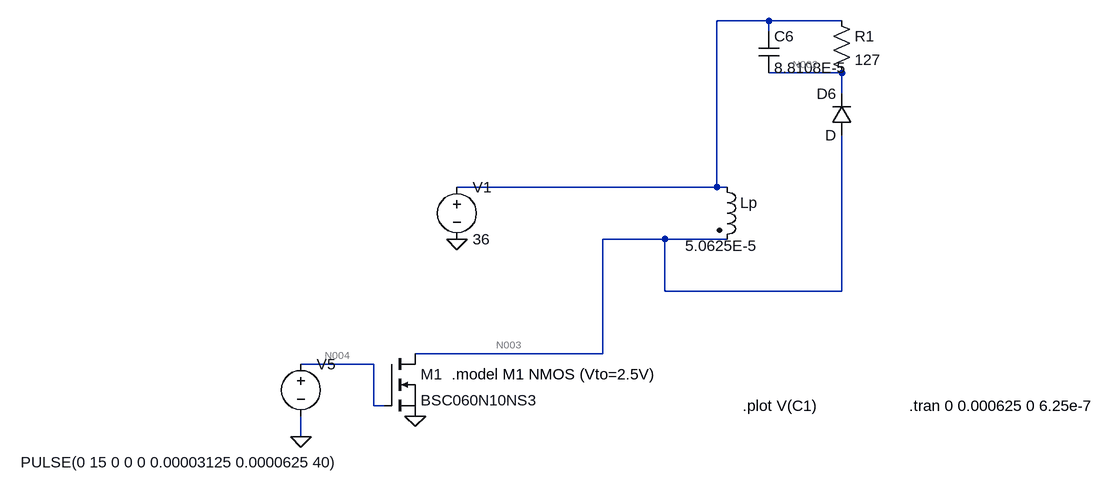
[diagram p0: schematic DriverSnubberModelling1.asc]
DriverSnubberModelling1.asc, the LTspice schematic file:
Version 4
SHEET 1 880 832
WIRE -624 -192 -704 -192
WIRE -512 -192 -624 -192
WIRE -624 -176 -624 -192
WIRE -512 -112 -624 -112
WIRE -512 -80 -512 -112
WIRE -704 64 -704 -192
WIRE -704 64 -1104 64
WIRE -688 64 -704 64
WIRE -784 144 -880 144
WIRE -688 144 -784 144
WIRE -784 224 -784 144
WIRE -512 224 -512 -16
WIRE -512 224 -784 224
WIRE -880 320 -880 144
WIRE -880 320 -1168 320
WIRE -1232 336 -1344 336
WIRE -1232 400 -1232 336
WIRE -1216 400 -1232 400
WIRE -1344 448 -1344 416
FLAG -1104 144 0
FLAG -1344 448 0
FLAG -1168 416 0
SYMBOL ind2 -704 48 R0
WINDOW 3 -49 106 Left 2
SYMATTR Value 5.0625E-5
SYMATTR InstName Lp
SYMATTR Type ind
SYMBOL voltage -1104 48 R0
WINDOW 123 0 0 Left 0
WINDOW 39 0 0 Left 0
SYMATTR InstName V1
SYMATTR Value 36
SYMBOL voltage -1344 320 R0
WINDOW 3 -431 167 Left 2
WINDOW 123 0 0 Left 0
WINDOW 39 0 0 Left 0
SYMATTR Value PULSE(0 15 0 0 0 0.00003125 0.0000625 40)
SYMATTR InstName V5
SYMBOL nmos -1216 320 R0
SYMATTR InstName M1
SYMATTR Value BSC060N10NS3
SYMBOL res -528 -208 R0
SYMATTR InstName R1
SYMATTR Value 127
SYMBOL cap -640 -176 R0
SYMATTR InstName C6
SYMATTR Value 8.8108E-5
SYMBOL diode -496 -16 R180
WINDOW 0 24 64 Left 2
WINDOW 3 24 0 Left 2
SYMATTR InstName D6
TEXT -408 400 Left 2 !.tran 0 0.000625 0 6.25e-7
TEXT -664 400 Left 2 !.plot V(C1)
TEXT -1112 352 Left 2 !.model M1 NMOS (Vto=2.5V)

The netlist it stands for:
* DriverSnubberModelling1.asc
Lp N001 N003 5.0625E-5
V1 N001 0 36
V5 N004 0 PULSE(0 15 0 0 0 0.00003125 0.0000625 40)
M1 N003 N004 0 0 BSC060N10NS3
R1 N001 N002 127
C6 N001 N002 8.8108E-5
D6 N003 N002 D
.model D D
.lib standard.dio
.model NMOS NMOS
.model PMOS PMOS
.lib standard.mos
.tran 0 0.000625 0 6.25e-7
.plot V(C1)
.model M1 NMOS (Vto=2.5V)
.backanno
.end

* Results of the author's LTspice run, read from the files saved beside the schematic
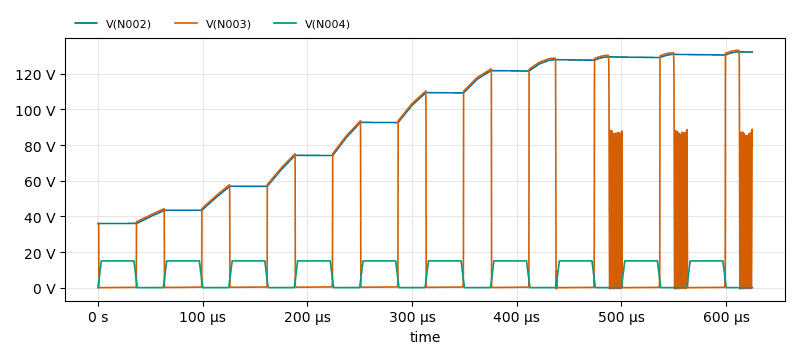
[diagram p1: Transient Analysis of DriverSnubberModelling1.asc, plotted from the saved traces]
* Transient Analysis, 1 run:
*   V(N002): min 36 V, max 132.3 V, average 94.34 V, rms 100.5 V, last 132.2 V
*   V(N003): min -643.8 mV, max 133.2 V, average 35.94 V, rms 60.39 V, last 78.93 V
*   V(N004): min 0 V, max 15 V, average 8.25 V, rms 10.96 V, last 0 V